# EAGLE design TeachingInstrument_power_supply_v2 (EAGLE 9.6.2)
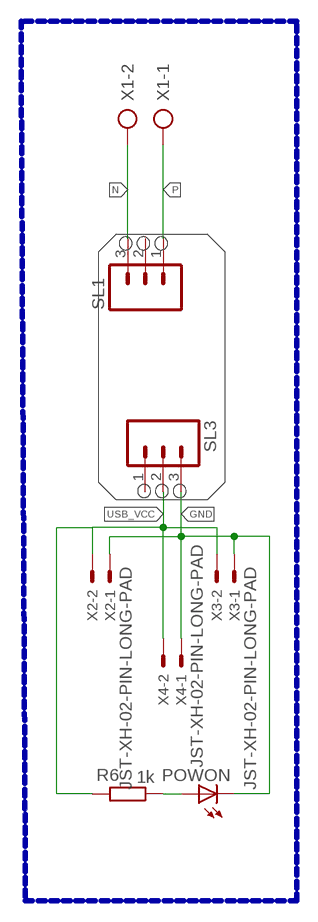
[diagram p0: schematic, sheet 1]

## Parts
POWON  LED3MM  [LED3MM]
R6  1k  R-EU_0204/7  [0204/7]
SL1  M03  [03P]
SL3  M03  [03P]
X1  AK500/2-H  [AK500/2-H]
X2  JST-XH-02-PIN-LONG-PAD  [JST-XH-02-PACKAGE-LONG-PAD]
X3  JST-XH-02-PIN-LONG-PAD  [JST-XH-02-PACKAGE-LONG-PAD]
X4  JST-XH-02-PIN-LONG-PAD  [JST-XH-02-PACKAGE-LONG-PAD]

## Nets
GND: POWON.K(C) SL3.3 X2.1 X3.1 X4.1
N: SL1.3 X1.2
N$16: POWON.A R6.1
P: SL1.1 X1.1
USB_VCC: R6.2 SL3.2 X2.2 X3.2 X4.2
Unconnected: SL1.2 SL3.1

## Buses
B$1

## Library data of the parts
POWON = CEDT_SEPTEMBER_V2:LED
R6 = rcl:R-EU_: RESISTOR, European symbol
SL1 SL3 = con-amp-quick:M03: AMP QUICK CONNECTOR; OC_FARNELL: unknown; OC_NEWARK: unknown
X1 = con-ptr500:AK500/2-H: CONNECTOR Aug. 2004 / PTR Meßtechnik: Die Bezeichnung der Serie AK505 wurde geändert. Es handelt sich hierbei um AK500 in horizontaler Ausführung.; OC_FARNELL: unknown; OC_NEWARK: unknown
X2-X4 = Rembrandt_Electronics_-_JST_XH_Connectors_v1-0:JST-XH-02-PIN: JST XH Connector 2 Pin Wire to board connector. Pitch: 2,54 mm, (0.100") Number of pins: 2 Created by Rembrandt Electronics www.rembrandtelectronics.com

## Board
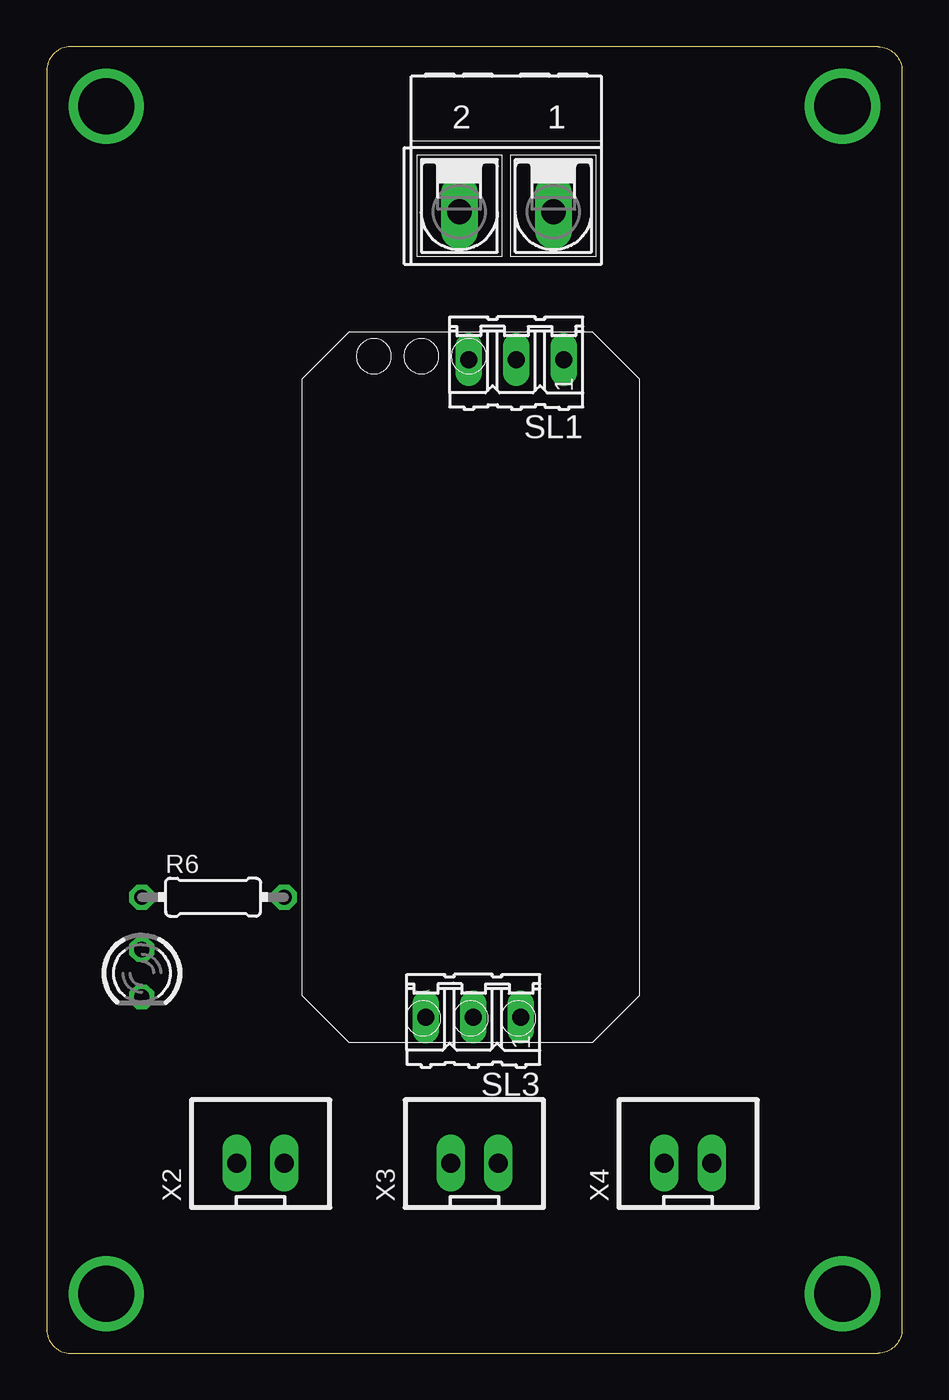
[diagram p1: board, top side]
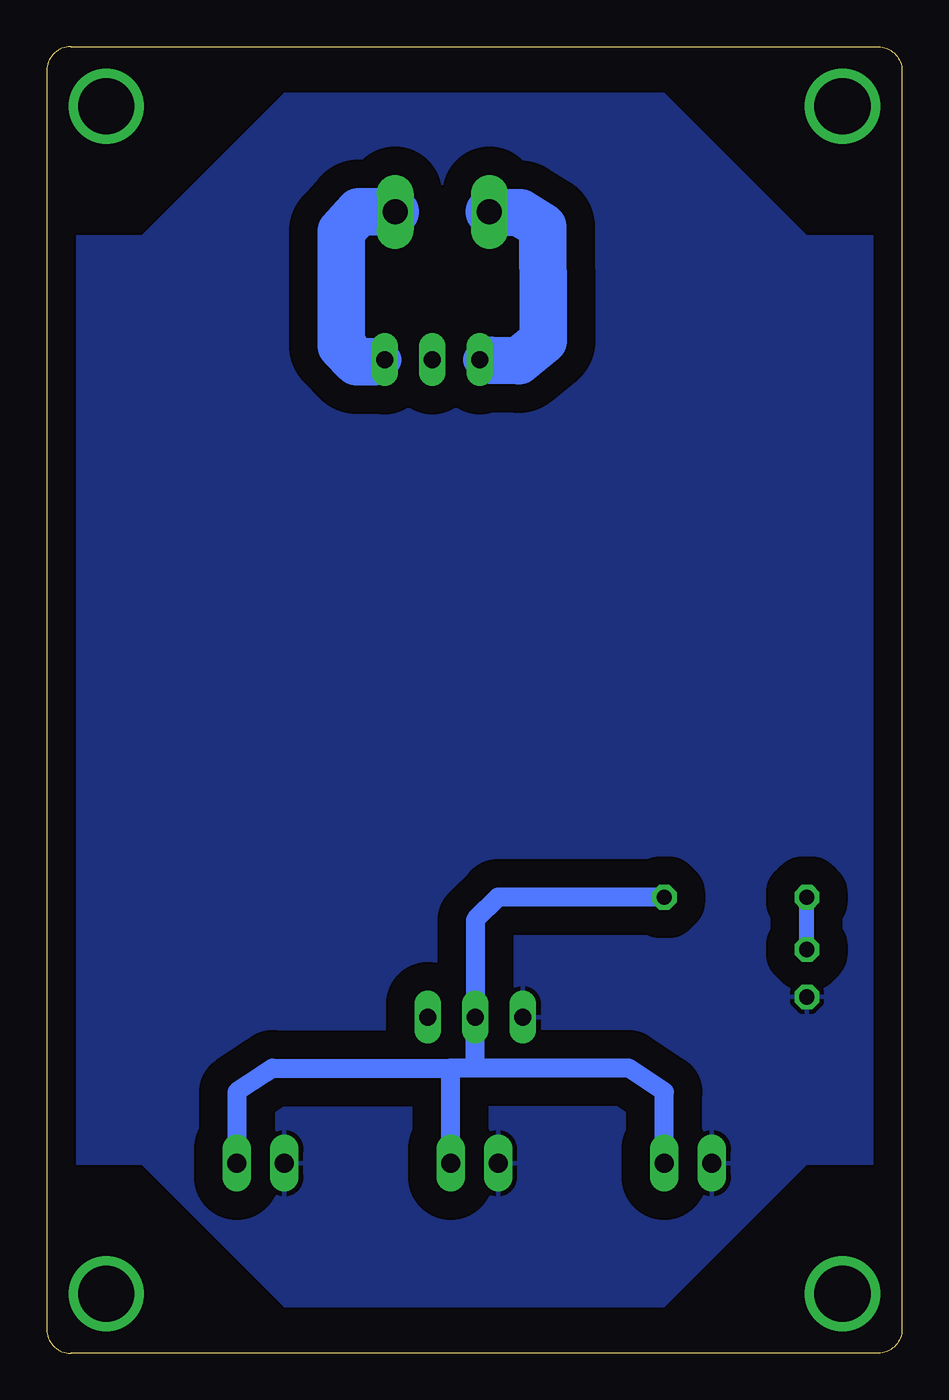
[diagram p2: board, bottom side, seen from below]

Size 45.72 x 69.85 mm. Coordinates in mm from the lower left corner, seen from the top.
Outline: 44.45,69.85 arc-90 45.72,68.58 45.72,1.27 arc-90 44.45,0 1.27,0 arc-90 0,1.27 0,68.58 arc-90 1.27,69.85 44.45,69.85
Copper layers (1*16): Top 0.035mm / dielectric 1.5mm / Bottom 0.035mm
Design rules "default *": minimum track width 6mil, minimum drill 0.35mm, track to track 12mil, track to pad 12mil, pad to pad 12mil, via to via 12mil, smd to smd 12mil, copper to edge 40mil, drill to drill 6mil, minimum pad ring 10mil, minimum via ring 8mil, stop-mask expansion 4mil, vias tented up to drill 0mil, thermal gap 10mil

### Footprints (pad centres in the part's own frame; a part is rotated, then mirrored left to right if it is on the bottom)
LED3MM = drill 0.813 octagon: A -1.27,0; K 1.27,0
0204/7 = drill 0.813 octagon: 1 -3.81,0; 2 3.81,0
03P = drill 0.914 long: 1 -2.54,0; 2 0,0; 3 2.54,0
AK500/2-H = drill 1.321 long: 1 -2.515,0; 2 2.515,0
JST-XH-02-PACKAGE-LONG-PAD = drill 1.016 long: 1 -1.27,0; 2 1.27,0

### Placement (x,y rotation side)
POWON  5.08,20.32 270 top
R6  8.89,24.38 0 top
SL1  25.1,53.12 180 top
SL3  22.81,17.97 180 top
X1  24.57,61.02 180 top
X2  11.43,10.16 0 top
X3  22.86,10.16 0 top
X4  34.29,10.16 0 top

### Tracks (layer width: path | path; a pad name or v marks a point on that pad's centre or on a via)
GND
  pour Bottom (isolate 1.524): 1.27,59.69 5.08,59.69 12.7,67.31 33.02,67.31 40.64,59.69 44.45,59.69 44.45,10.16 40.64,10.16 33.02,2.54 12.7,2.54 5.08,10.16 1.27,10.16
N
  Bottom 1.778: 21.97,53.1 SL1.3
  Bottom 2.54: X1.2 20.4,60.98 19.21,60.24 19.16,55.66 19.18,54.13 20.48,53.07 21.97,53.1
N$1  (via drill 3 pad 4)
  other vias: 3.17,66.67
N$2  (via drill 3 pad 4)
  other vias: 42.55,3.17
N$3  (via drill 3 pad 4)
  other vias: 42.55,66.67
N$8  (via drill 3 pad 4)
  other vias: 3.17,3.17
N$16
  Bottom 0.813: POWON.A R6.1
P
  Bottom 1.778: 28.21,53.02 SL1.1
  Bottom 2.54: X1.1 29.04,61.02 29.97,59.99 29.97,53.86 29.15,53.02 28.21,53.02
USB_VCC
  Bottom 1.016: X2.2 12.7,13.97 14.61,15.24 22.81,15.24 | 22.81,15.24 24.13,15.24 | 24.13,15.24 33.66,15.24 34.09,14.95 35.56,13.97 X4.2 | X3.2 24.13,15.24 | 22.81,15.24 SL3.2 22.81,23.16 21.59,24.38 R6.2